# EAGLE design SparkFun_Tranceiver_Breakout-nRF24L01 (EAGLE 7.2.0)
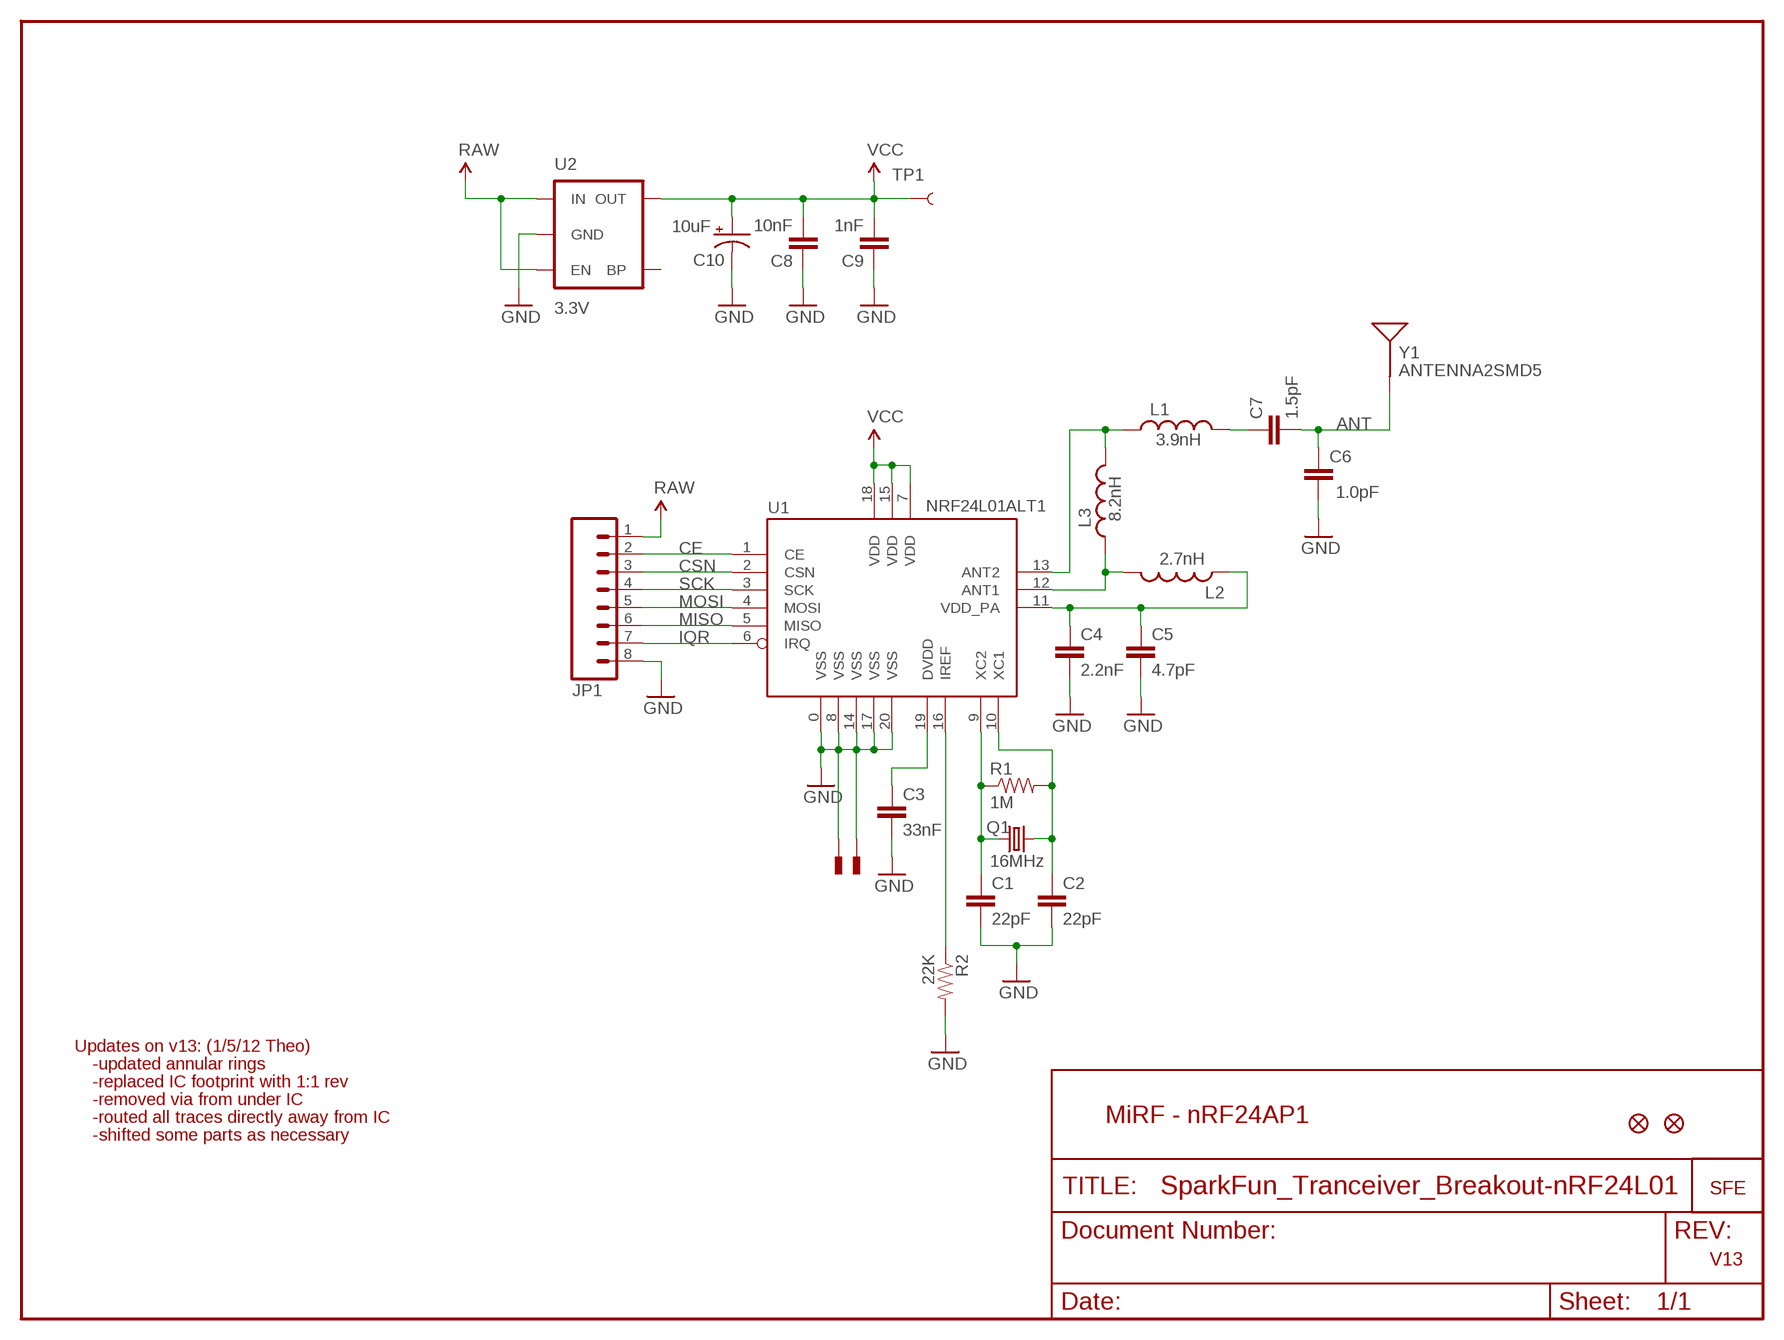
[diagram p0: schematic, sheet 1]

## Parts
C1  22pF  CAP0402-CAP  [0402-CAP]
C2  22pF  CAP0402-CAP  [0402-CAP]
C3  33nF  CAP0402-CAP  [0402-CAP]
C4  2.2nF  CAP0402-CAP  [0402-CAP]
C5  4.7pF  CAP0402-CAP  [0402-CAP]
C6  1.0pF  CAP0402-CAP  [0402-CAP]
C7  1.5pF  CAP0402-CAP  [0402-CAP]
C8  10nF  CAP0402-CAP  [0402-CAP]
C9  1nF  CAP0402-CAP  [0402-CAP]
C10  10uF  CAP_POL1206  [EIA3216]
JP1  M081X08  [1X08]
JP2  FIDUCIALUFIDUCIAL  [MICRO-FIDUCIAL]
JP3  FIDUCIALUFIDUCIAL  [MICRO-FIDUCIAL]
L1  3.9nH  INDUCTOR0402  [C0402]
L2  2.7nH  INDUCTOR0402  [C0402]
L3  8.2nH  INDUCTOR0402  [C0402]
Q1  16MHz  CRYSTAL5X3  [CRYSTAL-SMD-5X3]
R1  1M  RESISTOR0402-RES  [0402-RES]
R2  22K  RESISTOR0402-RES  [0402-RES]
TP1  TEST-POINT3X5  [PAD.03X.05]
U1  NRF24L01ALT1  [QFN20_ALT1]
U2  3.3V  V_REG_LDOSMD  [SOT23-5]
U$1  PAD  [PAD-0.008]
U$4  PAD  [PAD-0.008]
U$5  LOGO-SFENEW  [SFE-NEW-WEBLOGO]
Y1  ANTENNA2SMD5  [ANTENNA-CHIP5]

## Nets
ANT: C6.2 C7.2 Y1.FEED(SIGNAL)
CE: JP1.2 U1.1(CE)
CSN: JP1.3 U1.2(CSN)
GND: C1.2 C2.2 C3.2 C4.2 C5.2 C6.1 C8.1 C9.1 C10.C(-) JP1.8 R2.2 U1.0(VSS) U1.8(VSS) U1.14(VSS) U1.17(VSS) U1.20(VSS) U2.2(GND) U$1.P$1 U$4.P$1
IQR: JP1.7 U1.6(IRQ)
MISO: JP1.6 U1.5(MISO)
MOSI: JP1.5 U1.4(MOSI)
N$1: C1.1 Q1.1 R1.1 U1.9(XC2)
N$2: C2.1 Q1.3 R1.2 U1.10(XC1)
N$3: L2.2 L3.1 U1.12(ANT1)
N$4: R2.1 U1.16(IREF)
N$5: C3.1 U1.19(DVDD)
N$6: L1.1 L3.2 U1.13(ANT2)
N$7: C4.1 C5.1 L2.1 U1.11(VDD_PA)
N$9: C7.1 L1.2
RAW: JP1.1 U2.1(IN) U2.3(EN)
SCK: JP1.4 U1.3(SCK)
VCC: C8.2 C9.2 C10.A(+) TP1.P$1 U1.7(VDD) U1.15(VDD) U1.18(VDD) U2.5(OUT)
Unconnected: U2.4(BP)

## Notes on the sheet
- Updates on v13: (1/5/12 Theo)
- -updated annular rings
- -replaced IC footprint with 1:1 rev
- -removed via from under IC
- -routed all traces directly away from IC | MiRF - nRF24AP1
- -shifted some parts as necessary
- V13

## Library data of the parts
C1-C9 = SparkFun:CAP: Capacitor Standard 0603 ceramic capacitor, and 0.1" leaded capacitor.
C10 = SparkFun:CAP_POL: Capacitor Polarized These are standard SMD and PTH capacitors. Normally 10uF, 47uF, and 100uF in electrolytic and tantalum varieties. Always verify the external diameter of the through hole cap, it varies with capacity, voltage, and manufacturer. The EIA devices should be standard.
JP1 = SparkFun:M08: Header 8 Standard 8-pin 0.1" header. Use with straight break away headers (SKU : PRT-00116), right angle break away headers (PRT-00553), swiss pins (PRT-00743), machine pins (PRT-00117), and female headers (PRT-00115).
JP2 JP3 = SparkFun:FIDUCIAL: Fiducial Alignment Points Various fiducial points for machine vision alignment.
L1-L3 = SparkFun:INDUCTOR: Inductors Basic Inductor/Choke - 0603 and 1206. Footprints are not proven and vary greatly between part numbers.
Q1 = SparkFun:CRYSTAL: Crystals Various standard crystals. Proven footprints. Spark Fun Electronics SKU : COM-00534
R1 R2 = SparkFun:RESISTOR: Resistor Basic schematic elements and footprints for 0603, 1206, and PTH resistors.
TP1 = SparkFun:TEST-POINT
U1 = Testing:NRF24L01: 2.4GHz Low Power Transceiver This is the very popular, low cost, very low power RF transceiver from Nordic Semiconductor. Simple SPI interface. SKU: COM-00690
U2 = SparkFun:V_REG_LDO: Voltage Regulator LDO Standard 150mA LDO voltage regulator in SOT-23 layout. Micrel part MIC5205. BP (by-pass) pin is used to lower output noise with 470pF cap.
U$1 U$4 = Testing:PAD
U$5 = SparkFun:LOGO-SFE: Spark Fun Electronics PCB Logo This is the standard Spark Fun Electronics PCB logo.
Y1 = SparkFun:ANTENNA2: Antenna Single endded antenna. Common with smaller chip antennas. CHIP4 package is the GPS Chip Antenna SKU: GPS-08418. CHIP5 package is 2.4GHz chip antenna SKU: WRL-00144.

## Board
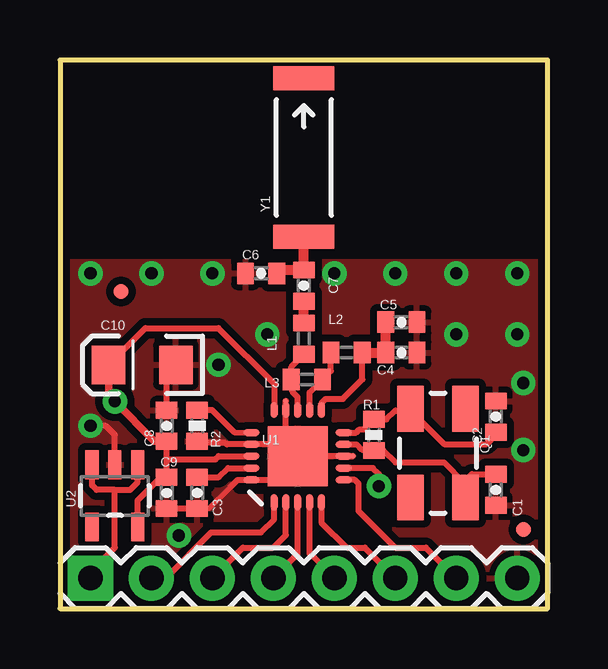
[diagram p1: board, top side]
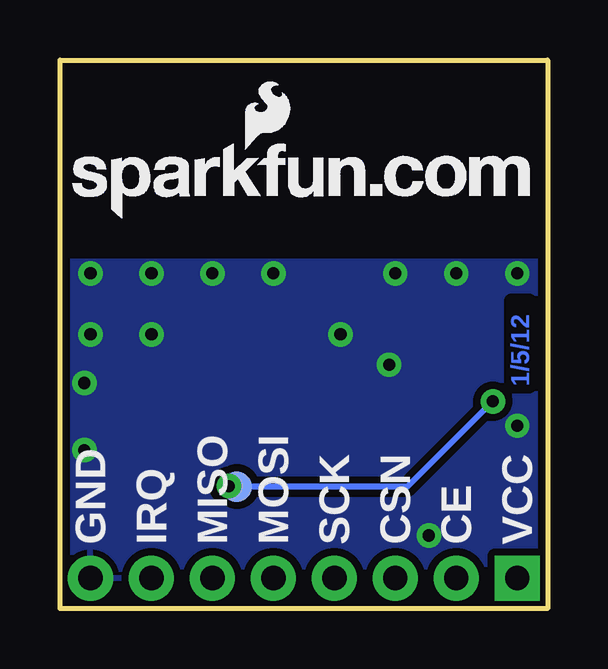
[diagram p2: board, bottom side, seen from below]

Size 20.32 x 22.86 mm. Coordinates in mm from the lower left corner, seen from the top.
Outline: 0,0 20.32,0 20.32,22.86 0,22.86 0,0
Copper layers (1*16): Top 0.035mm / dielectric 1.5mm / Bottom 0.035mm
Design rules "default": minimum track width 8mil, minimum drill 20mil, track to track 8mil, track to pad 8mil, pad to pad 8mil, via to via 8mil, smd to smd 8mil, copper to edge 8mil, drill to drill 8mil, minimum pad ring 12mil, minimum via ring 10mil, stop-mask expansion 4mil, vias tented up to drill 20mil, thermal gap 10mil
tRestrict: area 7.5,5.1 to 8.4,5.6

### Footprints (pad centres in the part's own frame; a part is rotated, then mirrored left to right if it is on the bottom)
0402-CAP = smd 0.7 x 0.9: 1 -0.65,0; 2 0.65,0
EIA3216 = smd 1.4 x 1.6: A 1.4,0; C -1.4,0
1X08 = drill 1.016 pad 1.88 square: 1 0,0 | drill 1.016 pad 1.88: 2 2.54,0; 3 5.08,0; 4 7.62,0; 5 10.16,0; 6 12.7,0; 7 15.24,0; 8 17.78,0
MICRO-FIDUCIAL = smd 0.635 x 0.635: 1 0,0
C0402 = smd 0.7 x 0.9: 1 -0.65,0; 2 0.65,0
CRYSTAL-SMD-5X3 = smd 1.9 x 1.1: 1 -1.85,-1.15; 2 1.85,-1.15; 3 1.85,1.15; 4 -1.85,1.15
0402-RES = smd 0.7 x 0.9: 1 -0.65,0; 2 0.65,0
PAD.03X.05 = smd 1.27 x 1.27: P$1 0,0
QFN20_ALT1 = smd 2.515 x 2.515: 0 0,0 | smd 0.686 x 0.293: 1 -1.925,0.986; 2 -1.925,0.493; 3 -1.925,0; 4 -1.925,-0.493; 5 -1.925,-0.986; 11 1.925,-0.986; 12 1.925,-0.493; 13 1.925,0; 14 1.925,0.493; 15 1.925,0.986 | smd 0.293 x 0.686: 6 -0.986,-1.925; 7 -0.493,-1.925; 8 0,-1.925; 9 0.493,-1.925; 10 0.986,-1.925; 16 0.986,1.925; 17 0.493,1.925; 18 0,1.925; 19 -0.493,1.925; 20 -0.986,1.925
SOT23-5 = smd 0.55 x 1.2: 1 -0.95,-1.3; 2 0,-1.3; 3 0.95,-1.3; 4 0.95,1.3; 5 -0.95,1.3
PAD-0.008 = smd 0.203 x 0.203: P$1 0,0
ANTENNA-CHIP5 = smd 1.016 x 2.54: FEED -3.302,0; NC 3.302,0

### Placement (x,y rotation side)
C1  18.16,4.95 270 top
C2  18.16,8 90 top
C3  5.71,4.83 270 top
C4  14.22,10.67 0 top
C5  14.22,11.94 0 top
C6  8.38,13.97 0 top
C7  10.16,13.46 90 top
C8  4.45,7.62 270 top
C9  4.45,4.83 90 top
C10  3.43,10.16 180 top
JP1  1.27,1.27 0 top
JP2  2.54,13.21 0 top
JP3  19.3,3.3 0 top
L1  10.16,11.25 90 top
L2  11.94,10.67 180 top
L3  10.29,9.55 180 top
Q1  15.75,6.48 90 top
R1  13.08,7.24 90 top
R2  5.71,7.62 270 top
TP1  12.95,5.08 0 bottom
U1  9.91,6.35 90 top
U2  2.29,4.7 180 top
U$1  9.4,8.66 0 top
U$4  12.22,6.35 0 top
U$5  19.81,16.26 0 bottom
Y1  10.16,18.8 90 top

### Tracks (layer width: path | path; a pad name or v marks a point on that pad's centre or on a via)
ANT
  Top 0.203: C6.2 9.14,13.97 9.28,14.11
  Top 0.406: 9.28,14.11 C7.2 10.16,14.22 Y1.FEED
CE
  Top 0.254: U1.1 8.92,3.71 8.38,3.17 6.3,3.17 4.42,1.29 3.83,1.29 JP1.2
CSN
  Top 0.254: JP1.3 7.62,2.54 8.89,2.54 9.41,3.06 U1.2
GND  (via drill 0.51)
  Top 0.203: C3.2 6.21,4.18 7.11,5.08
  Top 0.254: C10.C 4.45,9.91 C8.1 | C3.2 C9.1 | v1.27,7.62 1.91,7.62 2.29,7.24 U2.2 | 9.41,6.84 U1.17 6.95,6.84 6.88,6.91 5.78,6.91 R2.2 | 9.41,6.84 U1.14 9.41,8.65 U$1.P$1 | 9.41,6.84 U1.0 8.92,5.36 U1.20 7.4,5.36 7.11,5.08 | 10.16,6.35 U$4.P$1 U1.8
  other vias: 4.95,3.05 1.27,13.97 3.81,13.97 6.35,13.97 6.6,10.16 8.64,11.43 11.43,13.97 13.97,13.97 16.51,13.97 19.05,13.97 16.51,11.43 19.05,11.43 19.3,9.4 19.3,6.6
  pour Bottom (isolate 0.305): 0,0 0,14.48 20.32,14.48 20.32,0
  pour Top (isolate 0.305): 0,0 0,14.48 20.32,14.48 20.32,0
IQR
  Top 0.254: JP1.7 15.24,2.54 13.97,2.54 12.45,4.06 12.45,5.21 12.29,5.36 U1.6
MISO
  Top 0.254: JP1.6 12.7,2.54 11.94,2.54 10.89,3.59 U1.5
MOSI
  Top 0.254: U1.4 10.4,2.3 JP1.5
N$1
  Top 0.254: R1.1 13.08,6.6 | R1.1 13.48,6.59 13.97,6.1 16,6.1 16.83,5.27 | 16.83,5.27 16.89,5.21 16.89,4.95 | 16.89,4.95 16.89,4.7 16.9,4.69 Q1.1 | 16.89,4.95 17.02,4.95 17.29,5.22 | 16.83,5.27 16.76,5.21 | C1.1 17.16,5.6 16.83,5.27 | U1.9 12.36,6.84 12.57,6.63 13.04,6.63 R1.1
N$2
  Top 0.254: 14.6,8.38 14.61,8.38 14.61,8.76 | 14.6,8.38 Q1.3 14.6,8.26 16,6.86 17.78,6.86 18.16,7.24 C2.1 | 14.6,8.38 14.48,8.26 13.97,8.26 13.6,7.89 R1.2 12.66,7.47 12.47,7.47 12.34,7.34 U1.10
N$3
  Top 0.254: U1.12 10.4,9.01 L3.1 11.29,9.9 L2.2
N$4
  Top 0.254: U1.16 7.25,7.35 6.33,8.27 R2.1
N$5
  Top 0.254: C3.1 6.62,5.48 7,5.86 U1.19
N$6
  Top 0.254: U1.13 9.9,8.81 9.68,9.04 9.68,9.51 L3.2 9.64,10.08 L1.1
N$7
  Top 0.203: 13.57,10.65 | C4.1 13.57,10.65 | 13.57,10.65
  Top 0.254: L2.1 12.6,10.66 12.6,9.55 11.79,8.74 11.07,8.74 10.89,8.55 U1.11
  Top 0.406: 13.57,10.65 C5.1 | 13.59,10.67 | 13.59,10.67 C4.1 | L2.1 13.59,10.67
N$9
  Top 0.203: C7.1 10.16,12.7
  Top 0.406: L1.2 10.16,12.7
RAW
  Top 0.254: U2.1 3.24,5.27 2.92,4.95 2.29,4.95 | 2.29,4.95 1.52,4.95 1.34,5.14 U2.3 | JP1.1 1.27,1.52 2.29,2.54 2.29,4.95
SCK
  Top 0.254: U1.3 9.9,2.29 JP1.4
VCC  (via drill 0.51)
  Top 0.254: U2.5 3.24,4.51 4.21,5.48 C9.2 4.45,6.22 | U1.18 6.61,6.35 6.48,6.22 4.45,6.22 | 4.45,6.22 4.45,6.99 | C10.A 3.56,11.68 6.6,11.68 8.92,9.37 U1.15 | U1.7 13.04,5.86 13.28,5.61 v13.28,5.11
  Top 0.305: C10.A 2.03,8.89 v2.29,8.64 3.94,6.99 4.45,6.99 C8.2
  Bottom 0.254: v13.28,5.11 13.08,5.08 TP1.P$1 5.84,5.08 v2.29,8.64

### Text on the board
Bottom: 1/5/12
bPlace: VCC | CE | CSN | SCK | MOSI | MISO | IRQ | GND
tValues: DNP